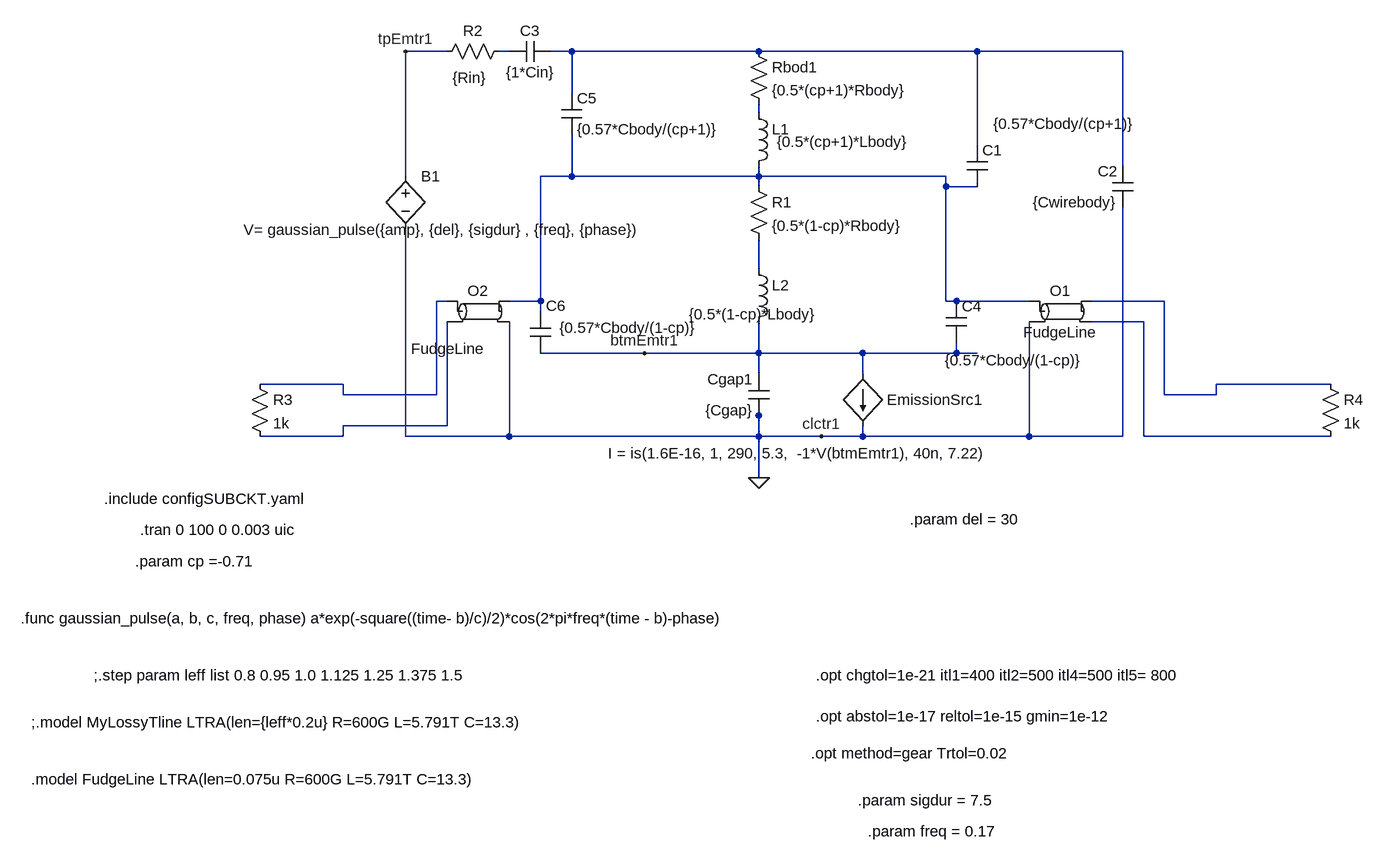
[diagram p0: schematic update_antenna_modle_Copy.asc]
update_antenna_modle_Copy.asc, the LTspice schematic file:
Version 4.1
SHEET 1 1324 848
WIRE -480 -368 -544 -368
WIRE -384 -368 -400 -368
WIRE -288 -368 -320 -368
WIRE 0 -368 -288 -368
WIRE 336 -368 0 -368
WIRE 560 -368 336 -368
WIRE -288 -304 -288 -368
WIRE 0 -272 0 -288
WIRE 336 -224 336 -368
WIRE 560 -192 560 -368
WIRE -544 -176 -544 -368
WIRE -288 -176 -288 -240
WIRE -288 -176 -336 -176
WIRE 0 -176 0 -192
WIRE 0 -176 -288 -176
WIRE 288 -176 0 -176
WIRE 0 -160 0 -176
WIRE 288 -160 288 -176
WIRE 336 -160 288 -160
WIRE 0 -32 0 -80
WIRE -480 16 -496 16
WIRE -336 16 -336 -176
WIRE -336 16 -384 16
WIRE 288 16 288 -160
WIRE 304 16 288 16
WIRE 416 16 304 16
WIRE 624 16 512 16
WIRE -336 32 -336 16
WIRE 592 48 512 48
WIRE -176 96 -336 96
WIRE 0 96 0 48
WIRE 0 96 -176 96
WIRE 160 96 0 96
WIRE 304 96 304 80
WIRE 304 96 160 96
WIRE 336 96 304 96
WIRE 0 128 0 96
WIRE 160 128 160 96
WIRE -640 144 -768 144
WIRE 880 144 704 144
WIRE -640 160 -640 144
WIRE -496 160 -496 16
WIRE -496 160 -640 160
WIRE 624 160 624 16
WIRE 704 160 704 144
WIRE 704 160 624 160
WIRE 0 192 0 176
WIRE -480 208 -480 48
WIRE -480 208 -640 208
WIRE -640 224 -640 208
WIRE -640 224 -768 224
WIRE -544 224 -544 -96
WIRE -384 224 -384 48
WIRE -384 224 -544 224
WIRE 0 224 0 192
WIRE 0 224 -384 224
WIRE 96 224 0 224
WIRE 160 224 160 208
WIRE 160 224 96 224
WIRE 416 224 416 48
WIRE 416 224 160 224
WIRE 560 224 560 -128
WIRE 560 224 416 224
WIRE 592 224 592 48
WIRE 880 224 592 224
WIRE 0 288 0 224
FLAG -176 96 btmEmtr1
FLAG 96 224 clctr1
FLAG -544 -368 tpEmtr1
FLAG 0 288 0
SYMBOL cap 320 -224 R0
WINDOW 3 41 -33 Left 2
SYMATTR Value {0.57*Cbody/(cp+1)}
SYMATTR InstName C1
SYMBOL cap 16 192 R180
WINDOW 0 24 56 Left 2
WINDOW 3 24 8 Left 2
SYMATTR InstName Cgap1
SYMATTR Value {Cgap}
SYMBOL cap 576 -128 R180
WINDOW 0 24 56 Left 2
WINDOW 3 24 8 Left 2
SYMATTR InstName C2
SYMATTR Value {Cwirebody}
SYMBOL res -16 -384 R0
SYMATTR InstName Rbod1
SYMATTR Value {0.5*(cp+1)*Rbody}
SYMBOL res -16 -176 R0
SYMATTR InstName R1
SYMATTR Value {0.5*(1-cp)*Rbody}
SYMBOL ind -16 -288 R0
WINDOW 3 44 59 Left 2
SYMATTR Value {0.5*(cp+1)*Lbody}
SYMATTR InstName L1
SYMBOL ind -16 -48 R0
WINDOW 3 -92 84 Left 2
SYMATTR Value {0.5*(1-cp)*Lbody}
SYMATTR InstName L2
SYMBOL res -384 -384 R90
WINDOW 0 0 56 VBottom 2
WINDOW 3 41 61 VTop 2
SYMATTR InstName R2
SYMATTR Value {Rin}
SYMBOL cap -320 -384 R90
WINDOW 0 0 32 VBottom 2
WINDOW 3 32 32 VTop 2
SYMATTR InstName C3
SYMATTR Value {1*Cin}
SYMBOL cap 288 16 R0
WINDOW 3 -2 91 Left 2
SYMATTR Value {0.57*Cbody/(1-cp)}
SYMATTR InstName C4
SYMBOL cap -304 -304 R0
SYMATTR InstName C5
SYMATTR Value {0.57*Cbody/(cp+1)}
SYMBOL cap -352 32 R0
WINDOW 0 24 -9 Left 2
WINDOW 3 45 25 Left 2
SYMATTR InstName C6
SYMATTR Value {0.57*Cbody/(1-cp)}
SYMBOL ltline 464 32 R0
SYMATTR InstName O1
SYMATTR Value FudgeLine
SYMBOL ltline -432 32 R0
WINDOW 3 -46 42 Top 2
SYMATTR Value FudgeLine
SYMATTR InstName O2
SYMBOL bv -544 -192 R0
WINDOW 3 -249 98 Left 2
SYMATTR Value V= gaussian_pulse({amp}, {del}, {sigdur} , {freq}, {phase})
SYMATTR InstName B1
SYMBOL bi 160 128 R0
WINDOW 3 -392 122 Left 2
WINDOW 0 37 40 Left 2
SYMATTR Value I = is(1.6E-16, 1, 290, 5.3,  -1*V(btmEmtr1), 40n, 7.22)
SYMATTR InstName EmissionSrc1
SYMBOL res -784 128 R0
SYMATTR InstName R3
SYMATTR Value 1k
SYMBOL res 864 128 R0
SYMATTR InstName R4
SYMATTR Value 1k
TEXT -1008 320 Left 2 !.include configSUBCKT.yaml
TEXT -952 368 Left 2 !.tran 0 100 0 0.003 uic
TEXT -960 416 Left 2 !.param cp =-0.71
TEXT -1024 592 Left 2 !;.step param leff list 0.8 0.95 1.0 1.125 1.25 1.375 1.5
TEXT -1136 504 Left 2 !.func gaussian_pulse(a, b, c, freq, phase) a*exp(-square((time- b)/c)/2)*cos(2*pi*freq*(time - b)-phase)
TEXT 232 352 Left 2 !.param del = 30
TEXT 80 712 Left 2 !.opt method=gear Trtol=0.02
TEXT 152 784 Left 2 !.param sigdur = 7.5
TEXT 168 832 Left 2 !.param freq = 0.17
TEXT -1120 664 Left 2 !;.model MyLossyTline LTRA(len={leff*0.2u} R=600G L=5.791T C=13.3)
TEXT -1120 752 Left 2 !.model FudgeLine LTRA(len=0.075u R=600G L=5.791T C=13.3)
TEXT 88 592 Left 2 !.opt chgtol=1e-21 itl1=400 itl2=500 itl4=500 itl5= 800\n \n.opt abstol=1e-17 reltol=1e-15 gmin=1e-12

The netlist it stands for:
* update_antenna_modle_Copy.asc
C1 N002 N004 {0.57*Cbody/(cp+1)}
Cgap1 0 btmEmtr1 {Cgap}
C2 0 N002 {Cwirebody}
Rbod1 N002 N003 {0.5*(cp+1)*Rbody}
R1 N004 N005 {0.5*(1-cp)*Rbody}
L1 N003 N004 {0.5*(cp+1)*Lbody}
L2 N005 btmEmtr1 {0.5*(1-cp)*Lbody}
R2 N001 tpEmtr1 {Rin}
C3 N002 N001 {1*Cin}
C4 N004 btmEmtr1 {0.57*Cbody/(1-cp)}
C5 N002 N004 {0.57*Cbody/(cp+1)}
C6 N004 btmEmtr1 {0.57*Cbody/(1-cp)}
O1 N004 0 N007 N008 FudgeLine
O2 N006 N009 N004 0 FudgeLine
B1 tpEmtr1 0 V= gaussian_pulse({amp}, {del}, {sigdur} , {freq}, {phase})
B§EmissionSrc1 btmEmtr1 0 I = is(1.6E-16, 1, 290, 5.3,  -1*V(btmEmtr1), 40n, 7.22)
R3 N006 N009 1k
R4 N007 N008 1k
.include configSUBCKT.yaml
.tran 0 100 0 0.003 uic
.param cp =-0.71
;.step param leff list 0.8 0.95 1.0 1.125 1.25 1.375 1.5
.func gaussian_pulse(a, b, c, freq, phase) a*exp(-square((time- b)/c)/2)*cos(2*pi*freq*(time - b)-phase)
.param del = 30
.opt method=gear Trtol=0.02
.param sigdur = 7.5
.param freq = 0.17
;.model MyLossyTline LTRA(len={leff*0.2u} R=600G L=5.791T C=13.3)
.model FudgeLine LTRA(len=0.075u R=600G L=5.791T C=13.3)
.opt chgtol=1e-21 itl1=400 itl2=500 itl4=500 itl5= 800
.opt abstol=1e-17 reltol=1e-15 gmin=1e-12
.backanno
.end